# Altium schematic sheet MCISO-S02-V00-12VProtection.SchDoc: 12V Protected Input
size A3; SheetNumber: 2; SheetTotal: 8
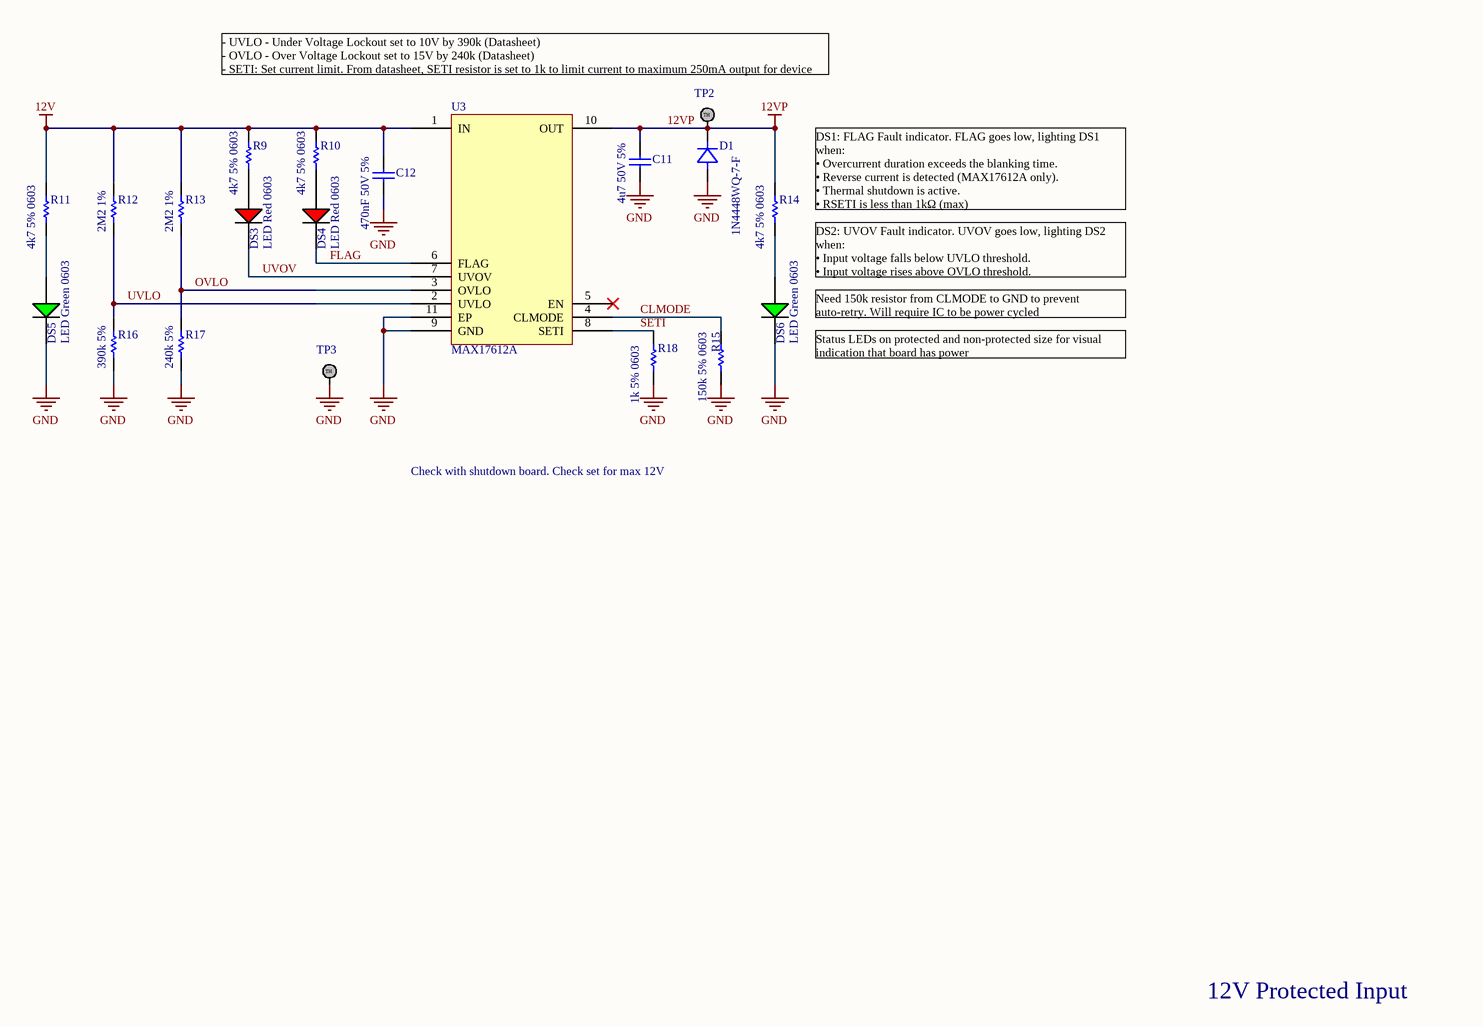
[diagram p0: MCISO-S02-V00-12VProtection.SchDoc]

## Parts
C11  4u7 50V 5%  [Cap_Ceramic_0603]
C12  470nF 50V 5%  [Cap_Ceramic_0603]
D1  1N4448WQ-7-F  [SMA]
DS3  LED Red 0603  [LED RED 0603]
DS4  LED Red 0603  [LED RED 0603]
DS5  LED Green 0603  [LED GREEN 0603]
DS6  LED Green 0603  [LED GREEN 0603]
R9  4k7 5% 0603  [Res_ThinFilm_0603]
R10  4k7 5% 0603  [Res_ThinFilm_0603]
R11  4k7 5% 0603  [Res_ThinFilm_0603]
R12  2M2 1%  [Res_ThinFilm_0603]
R13  2M2 1%  [Res_ThinFilm_0603]
R14  4k7 5% 0603  [Res_ThinFilm_0603]
R15  150k 5% 0603  [Res_ThinFilm_0603]
R16  390k 5%  [Res_ThinFilm_0603]
R17  240k 5%  [Res_ThinFilm_0603]
R18  1k 5% 0603  [Res_ThinFilm_0603]
TP2  TestPoint  [TestPointSMD]  (value not drawn)
TP3  TestPoint  [TestPointSMD]  (value not drawn)
U3  MAX17612A  [MAX17612A]

## Nets
12V: C12.2 R9.2 R10.2 R11.2 R12.2 R13.2 U3.1(IN)
12VP: C11.2 D1.K(Cathode) R14.2 TP2.1 U3.10(OUT)
GND: C11.1 C12.1 D1.A(Anode) DS5.2(C) DS6.2(C) R15.1 R16.1 R17.1 R18.1 TP3.1 U3.9(GND) U3.11(EP)
CLMODE: R15.2 U3.4(CLMODE)
FLAG: DS4.2(C) U3.6(FLAG)
OVLO: R13.1 R17.2 U3.3(OVLO)
SETI: R18.2 U3.8(SETI)
UVLO: R12.1 R16.2 U3.2(UVLO)
UVOV: DS3.2(C) U3.7(UVOV)
NetDS3_1: DS3.1(A) R9.1
NetDS4_1: DS4.1(A) R10.1
NetDS5_1: DS5.1(A) R11.1
NetDS6_1: DS6.1(A) R14.1

Not connected (* = marked no-connect by the designer): U3 5(EN)*

## Notes on the sheet
- - UVLO - Under Voltage Lockout set to 10V by 390k (Datasheet)
  - OVLO - Over Voltage Lockout set to 15V by 240k (Datasheet)
  - SETI: Set current limit. From datasheet, SETI resistor is set to 1k to limit current to maximum 250mA output for device
- (near R14) DS1: FLAG Fault indicator. FLAG goes low, lighting DS1 when:
  • Overcurrent duration exceeds the blanking time.
  • Reverse current is detected (MAX17612A only).
  • Thermal shutdown is active.
  • RSETI is less than 1kΩ (max)
- DS2: UVOV Fault indicator. UVOV goes low, lighting DS2 when:
  • Input voltage falls below UVLO threshold.
  • Input voltage rises above OVLO threshold.
- (near DS6) Need 150k resistor from CLMODE to GND to prevent auto-retry. Will require IC to be power cycled
- (near DS6) Status LEDs on protected and non-protected size for visual indication that board has power
- Check with shutdown board. Check set for max 12V
- 12V Protected Input
- (in symbol TestPoint) TH

## Library data of the parts
C11 = 4u7 50V 5% X7R 0603: Capacitor, Ceramic, SMD, 4u7, 50V, 5%, X7R, 0603
C12 = 470nF 50V 5% X7R 0603: Capacitor, Ceramic, SMD, 470nF, 50V, 5%, X7R, 0603
D1 = 1N4448WQ-7-F: Diode, SMD, 75V, 5%, 250mA, SOD123; Manufacturer: ON Semiconductor / Fairchild; Manufacturer Part Number: 1N914BWS; Average Rectified Current: 150mA; Element Configuration: Single; Forward Voltage: 1V; Max Reverse Leakage Current: 5uA; Power Dissipation: 200mW; Recovery Time: 4ns; Max Forward Surge Current (Ifsm): 4A; Parameter 1: *; Weight: 0.0276g; Category: Rectifier Diodes; Contact Plating: Tin,Matte; Forward Current: 150mA; Lead Free: Lead Free; Max Operating Temperature: 150°C; Max Repetitive Reverse Voltage (Vrrm): 75V; Max Reverse Voltage (DC): 75V; Min Operating Temperature: -55°C; Mount: Surface Mount; Number of Pins: 2; Package Quantity: 1; Packaging: Tape and Reel; Peak Reverse Current: 5uA; Radiation Hardening: No; REACH SVHC: No SVHC; Reverse Recovery Time: 4ns; Height: 1mm; Length: 1.8mm; Reverse Voltage: 75V; Width: 1.35mm
R9-R11 R14 = 4k7 5% 0603: Resistor, SMD, 4k7, 0.1W, 5%, 0603
R12 R13 = 2M2 1% 0603: Resistor, SMD, 2M2, 0.125W, 1%, 0603
R15 = 150k 5%, 0603: Resistor, SMD, 150k, 0.1W, 5%, 0603
R16 = 390k 5% 0603: Resistor, SMD, 390k, 0.1W, 5%, 0603
R17 = 240k 5% 0603: Resistor, SMD, 240k, 0.1W, 5%, 0603
R18 = 1k 5% 0603: Resistor, SMD, 1k, 0.1W, 5%, 0603
U3 = MAX17612A: 4.5V to 60V, 250mA Current-Limiter with OV, UV, and Reverse Protection; ComponentLink1Description: Datasheet; ComponentLink1URL: https://datasheets.maximintegrated.com/en/ds/MAX17612A-MAX17612C.pdf